# Altium project ZERO.PrjPcb
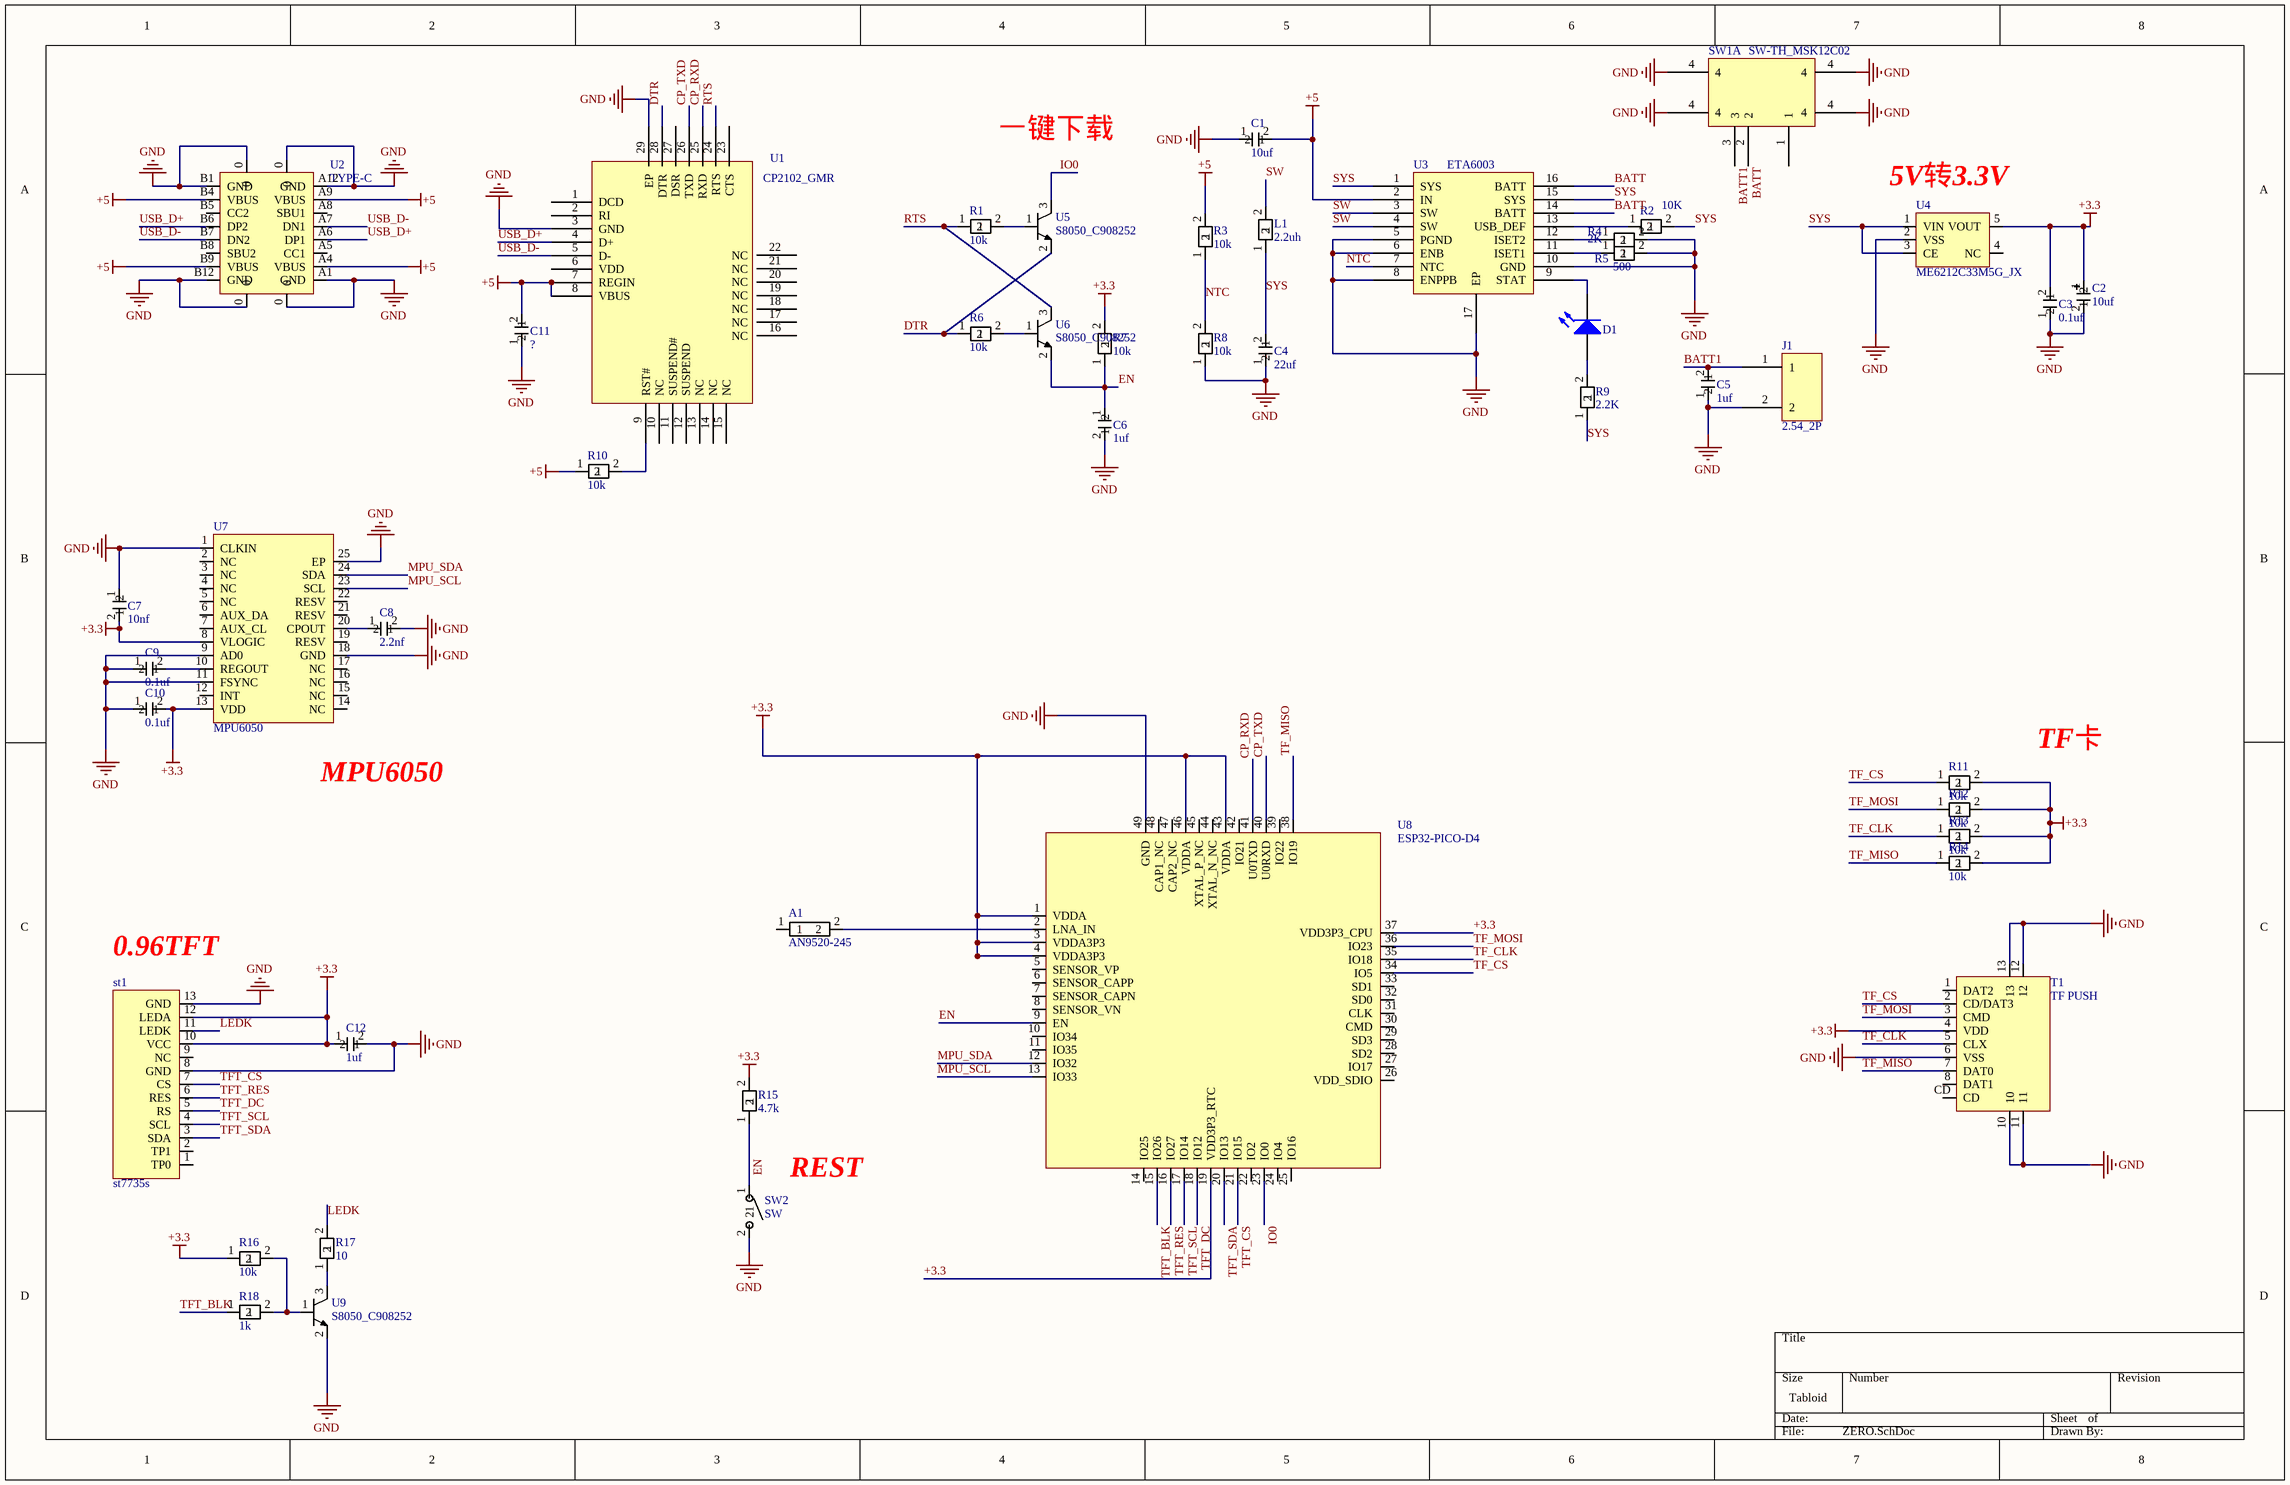
[diagram p0: ZERO.SchDoc]
1 sheet, 47 parts. Net scope: global (net labels, ports and power ports of the same name join across sheets).
Board file: ZERO.PcbDoc

## Sheet ZERO.SchDoc
size Tabloid

### Parts
A1  AN9520-245  [AN9520-245]
C1  10uf  [C0805]
C2  10uf  [C+]
C3  0.1uf  [C0805]
C4  22uf  [C0805]
C5  1uf  [C0805]
C6  1uf  [C0805]
C7  10nf  [C0805]
C8  2.2nf  [C0805]
C9  0.1uf  [C0805]
C10  0.1uf  [C0805]
C11  ?  [C0805]
C12  1uf  [C0805]
D1  LED 蓝 0805  [LED 蓝  0805]  (value not drawn)
J1  2.54_2P  [2.54-2P]
L1  2.2uh  [R0805]
R1  10k  [R0805]
R2  10K  [R0805]
R3  10k  [R0805]
R4  2K  [R0805]
R5  500  [R0805]
R6  10k  [R0805]
R7  10k  [R0805]
R8  10k  [R0805]
R9  2.2K  [R0805]
R10  10k  [R0805]
R11  10k  [R0805]
R12  10k  [R0805]
R13  10k  [R0805]
R14  10k  [R0805]
R15  4.7k  [R0805]
R16  10k  [R0805]
R17  10  [R0805]
R18  1k  [R0805]
st1  st7735s  [st7735s]
SW1  SW-TH_MSK12C02  [SW-TH_MSK12C02]  (part A of 3)
SW2  SW  [SW]
T1  TF PUSH  [TF-SMD_TF-PUSH]
U1  CP2102_GMR  [CP2102_GMR]
U2  TYPE-C  [USB-C]
U3  ETA6003  [ETA6003]
U4  ME6212C33M5G_JX  [ME6212C33M5G_JX]
U5  S8050_C908252  [s8050]
U6  S8050_C908252  [s8050]
U7  MPU6050  [MPU6050]
U8  ESP32-PICO-D4  [ESP32-PICO-D4]
U9  S8050_C908252  [s8050]

### Nets
+3.3: C2.1 C3.2 C7.2 C10.2 C12.1 R7.2 R11.2 R12.2 R13.2 R14.2 R15.2 R16.1 st1.10(VCC) st1.12(LEDA) T1.4(VDD) U4.5(VOUT) U7.8(VLOGIC) U7.13(VDD) U8.1(VDDA) U8.3(VDDA3P3) U8.4(VDDA3P3) U8.19(VDD3P3_RTC) U8.37(VDD3P3_CPU) U8.43(VDDA) U8.46(VDDA)
+5: C1.2 C11.2 R3.2 R10.1 U1.7(REGIN) U1.8(VBUS) U2.A4(VBUS) U2.A9(VBUS) U2.B4(VBUS) U2.B9(VBUS) U3.2(IN)
GND: C1.1 C2.2 C3.1 C4.1 C5.1 C6.2 C7.1 C8.2 C9.1 C10.1 C11.1 C12.2 J1.2 R4.2 R5.2 R8.1 st1.8(GND) st1.13(GND) SW1.4 SW2.2 T1.6(VSS) T1.10 T1.11 T1.12 T1.13 U1.3(GND) U1.29(EP) U2.0 U2.A1(GND) U2.A12(GND) U2.B1(GND) U2.B12(GND) U3.5(PGND) U3.6(ENB) U3.8(ENPPB) U3.10(GND) U3.17(EP) U4.2(VSS) U7.1(CLKIN) U7.9(AD0) U7.11(FSYNC) U7.18(GND) U7.25(EP) U8.49(GND) U9.2(E)
BATT: SW1.2 U3.14(BATT) U3.16(BATT)
BATT1: C5.2 J1.1 SW1.3
CP_RXD: U1.25(RXD) U8.41(U0TXD)
CP_TXD: U1.26(TXD) U8.40(U0RXD)
DTR: R6.1 U1.28(DTR) U5.2(E)
EN: C6.1 R7.1 R15.1 SW2.1 U6.2(E) U8.9(EN)
IO0: U5.3(C) U8.23(IO0)
LEDK: R17.2 st1.11(LEDK)
MPU_SCL: U7.23(SCL) U8.13(IO33)
MPU_SDA: U7.24(SDA) U8.12(IO32)
NTC: R3.1 R8.2 U3.7(NTC)
RTS: R1.1 U1.24(RTS) U6.3(C)
SW: L1.2 U3.3(SW) U3.4(SW)
SYS: C4.2 L1.1 R2.2 R9.1 U3.1(SYS) U3.15(SYS) U4.1(VIN) U4.3(CE)
TF_CLK: R13.1 T1.5(CLX) U8.35(IO18)
TF_CS: R11.1 T1.2(CD/DAT3) U8.34(IO5)
TF_MISO: R14.1 T1.7(DAT0) U8.38(IO19)
TF_MOSI: R12.1 T1.3(CMD) U8.36(IO23)
TFT_BLK: R18.1 U8.15(IO26)
TFT_CS: st1.7(CS) U8.21(IO15)
TFT_DC: st1.5(RS) U8.18(IO12)
TFT_RES: st1.6(RES) U8.16(IO27)
TFT_SCL: st1.4(SCL) U8.17(IO14)
TFT_SDA: st1.3(SDA) U8.20(IO13)
USB_D+: U1.4(D+) U2.A6(DP1) U2.B6(DP2)
USB_D-: U1.5(D-) U2.A7(DN1) U2.B7(DN2)
NetA1_2: A1.2 U8.2(LNA_IN)
NetC8_1: C8.1 U7.20(CPOUT)
NetC9_2: C9.2 U7.10(REGOUT)
NetD1_1: D1.1(A) R9.2
NetD1_2: D1.2(K) U3.9(STAT)
NetR1_2: R1.2 U5.1(B)
NetR2_1: R2.1 U3.13(USB_DEF)
NetR4_1: R4.1 U3.12(ISET2)
NetR5_1: R5.1 U3.11(ISET1)
NetR6_2: R6.2 U6.1(B)
NetR10_2: R10.2 U1.9(RST#)
NetR16_2: R16.2 R18.2 U9.1(B)
NetR17_1: R17.1 U9.3(C)

Not connected (* = marked no-connect by the designer): A1 1; st1 1(TP0) 2(TP1) 9(NC); SW1 1; T1 1(DAT2) 8(DAT1) CD; U1 1(DCD) 2(RI) 6(VDD) 10(NC) 11(SUSPEND#) 12(SUSPEND) 13(NC) 14(NC) 15(NC) 16(NC) 17(NC) 18(NC) 19(NC) 20(NC) 21(NC) 22(NC) 23(CTS) 27(DSR); U2 A5(CC1) A8(SBU1) B5(CC2) B8(SBU2); U4 4(NC); U7 2(NC) 3(NC) 4(NC) 5(NC) 6(AUX_DA) 7(AUX_CL) 12(INT) 14(NC) 15(NC) 16(NC) 17(NC) 19(RESV) 21(RESV) 22(RESV); U8 5(SENSOR_VP) 6(SENSOR_CAPP) 7(SENSOR_CAPN) 8(SENSOR_VN) 10(IO34) 11(IO35) 14(IO25) 22(IO2) 24(IO4) 25(IO16) 26(VDD_SDIO) 27(IO17) 28(SD2) 29(SD3) 30(CMD) 31(CLK) 32(SD0) 33(SD1) 39(IO22) 42(IO21) 44(XTAL_N_NC) 45(XTAL_P_NC) 47(CAP2_NC) 48(CAP1_NC)

### Notes on the sheet
- 一键下载
- (near U4) 5V转3.3V
- TF卡
- (near U7) MPU6050
- (near st1) 0.96TFT
- REST

### Library data of the parts
C1 C3-C12 = C0805
C2 = C+
L1 R1-R18 = R0805
U2 = TYPE-C: TYPE-C-31-M-12
U5 U6 U9 = s8050